# Altium schematic sheet connectors.SchDoc
size A
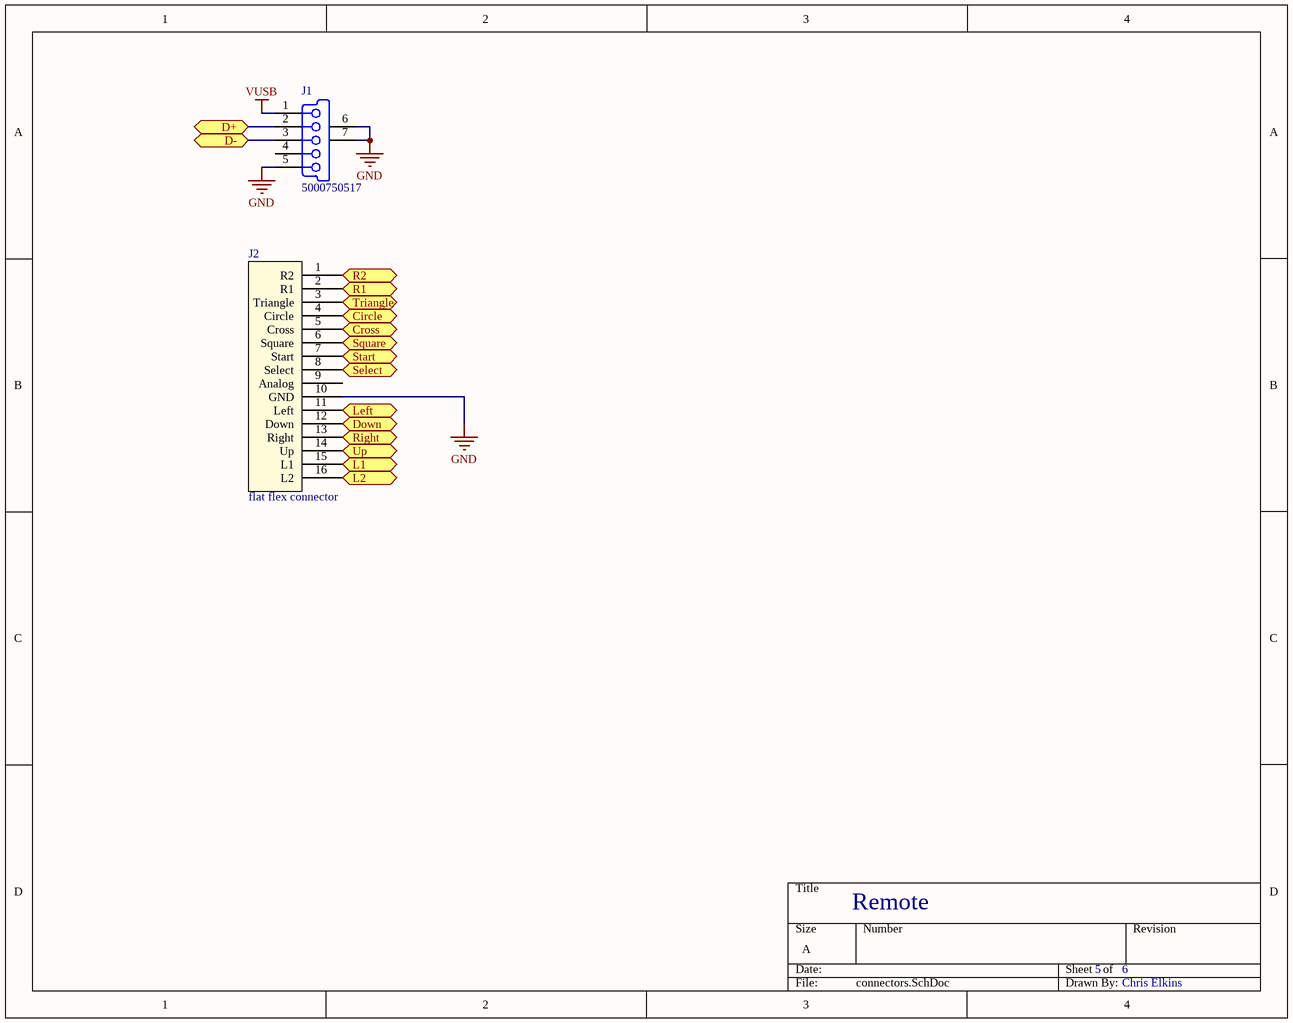
[diagram p0: connectors.SchDoc]

## Parts
J1  5000750517  [5000750517]
J2  flat flex connector  [flex con]

## Ports
Circle, Cross, D+ (bidir), D- (bidir), Down, L1, L2, Left, R1, R2, Right, Select, Square, Start, Triangle, Up

## Nets
GND: J1.5(GND) J1.6(MH1) J1.7(MH2) J2.10(GND)
VUSB: J1.1(V_BUS)
Circle: J2.4(Circle) ; port Circle
Cross: J2.5(Cross) ; port Cross
D+: J1.2(D-) ; port D+
D-: J1.3(D+) ; port D-
Down: J2.12(Down) ; port Down
L1: J2.15(L1) ; port L1
L2: J2.16(L2) ; port L2
Left: J2.11(Left) ; port Left
R1: J2.2(R1) ; port R1
R2: J2.1(R2) ; port R2
Right: J2.13(Right) ; port Right
Select: J2.8(Select) ; port Select
Square: J2.6(Square) ; port Square
Start: J2.7(Start) ; port Start
Triangle: J2.3(Triangle) ; port Triangle
Up: J2.14(Up) ; port Up

Not connected (* = marked no-connect by the designer): J1 4(ID); J2 9(Analog)

## Notes on the sheet
- Remote
- 5
- 6
- Chris Elkins

## Library data of the parts
J1 = 5000750517: USB On-The-Go (OTG) Mini-B Receptacle, Right Angle, Thru-Hole, 0.80mm (.031") Pitch, Solder Tails & Shell Tabs with Dimples; PCB_Layout: Complies with Manufacturer's Recommendation.; Published: 30-May-2008; DatasheetVersion: rev0, Mar-2004; PackageVersion: rev0, Mar-2004; PackageReference: 5000750517; Publisher: Altium Limited; PackageDescription: USB Mini-B, Type 2, Thru-Hole; 5 Position; Vertical, Body 7.7 x 4.2 x 7.7 mm (LxWxH); ComponentLink1Description: Manufacturer Link; ComponentLink1URL: http://www.molex.com/; ComponentLink2Description: Datasheet; ComponentLink2URL: http://www.molex.com/pdm_docs/sd/5000750517_sd.pdf